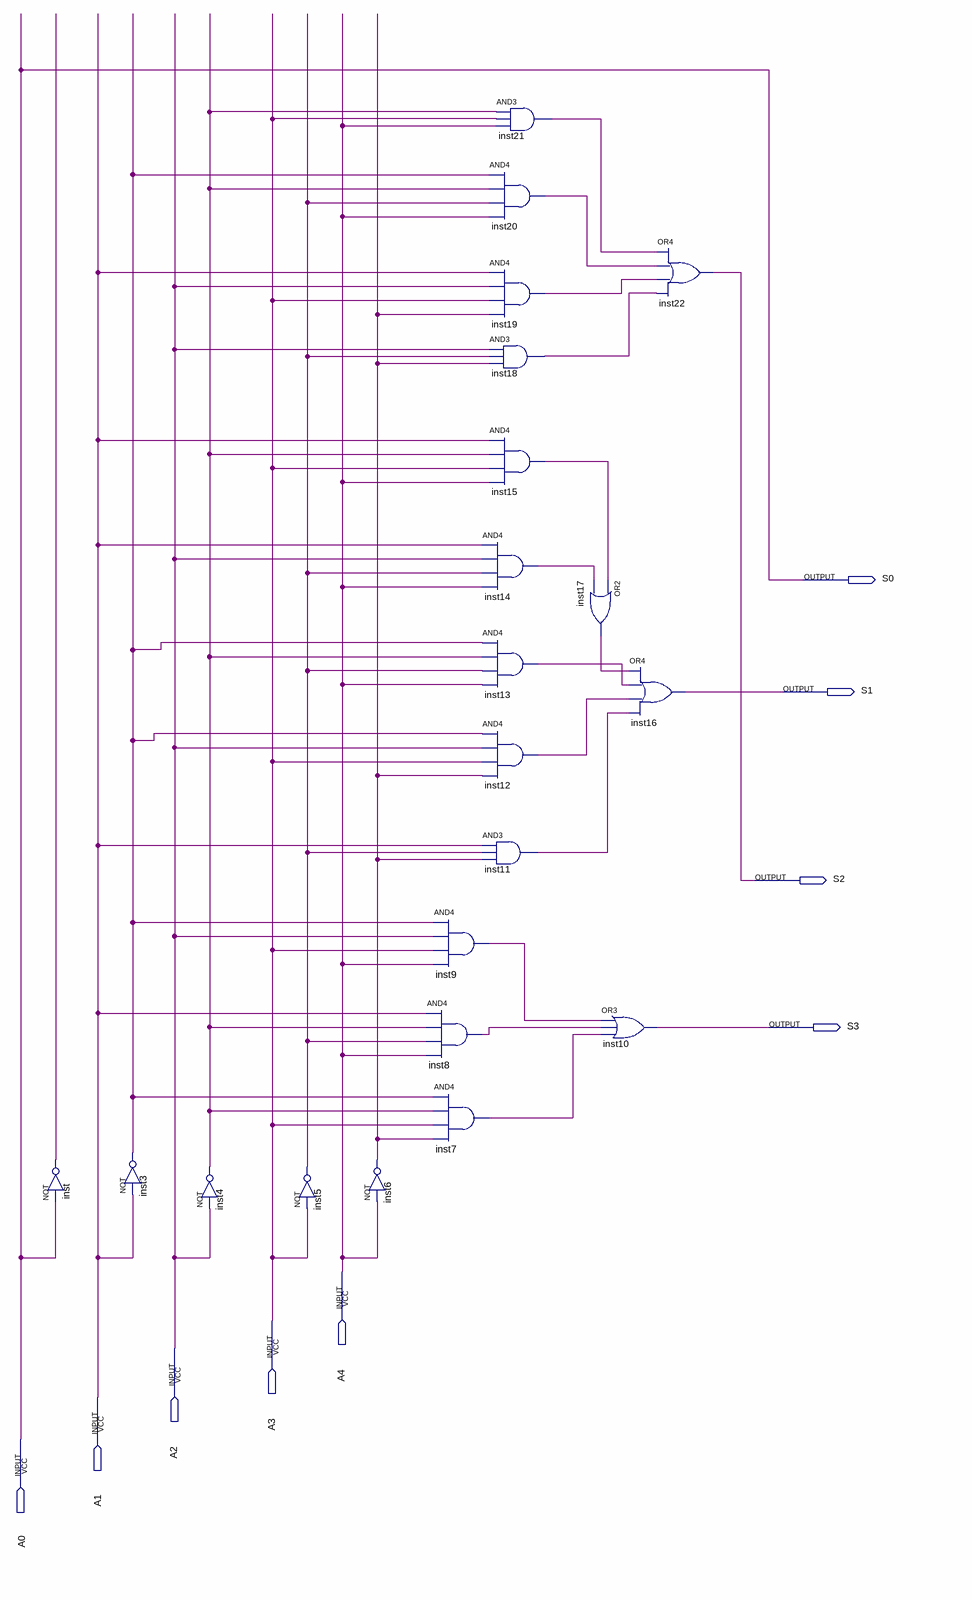
[diagram p0: schematic sheet]
// Quartus schematic decodificador6bit.bdf as structural Verilog: 21 symbols, 9 pins
module decodificador6bit (
  input  A4,
  input  A3,
  input  A2,
  input  A1,
  input  A0,
  output S0,
  output S1,
  output S2,
  output S3
);

  wire inst3_out, inst4_out, inst5_out, inst6_out, inst7_out, inst8_out, inst9_out, inst11_out, inst12_out,
       inst13_out, inst14_out, inst15_out, inst17_out, inst18_out, inst19_out, inst20_out, inst21_out,
       inst_out;

  not inst (inst_out, A0);
  not inst3 (inst3_out, A1);
  not inst4 (inst4_out, A2);
  not inst5 (inst5_out, A3);
  not inst6 (inst6_out, A4);
  and inst9 (inst9_out, inst3_out, A2, A3, A4);
  and inst8 (inst8_out, A1, inst4_out, inst5_out, A4);
  and inst7 (inst7_out, inst3_out, inst4_out, A3, inst6_out);
  and inst21 (inst21_out, inst4_out, A3, A4);
  and inst20 (inst20_out, inst3_out, inst4_out, inst5_out, A4);
  and inst19 (inst19_out, A1, A2, A3, inst6_out);
  and inst18 (inst18_out, A2, inst5_out, inst6_out);
  and inst15 (inst15_out, A1, inst4_out, A3, A4);
  and inst14 (inst14_out, A1, A2, inst5_out, A4);
  and inst13 (inst13_out, inst3_out, inst4_out, inst5_out, A4);
  and inst12 (inst12_out, inst3_out, A2, A3, inst6_out);
  and inst11 (inst11_out, A1, inst5_out, inst6_out);
  or inst17 (inst17_out, inst15_out, inst14_out);
  or inst10 (S3, inst9_out, inst8_out, inst7_out);
  or inst22 (S2, inst21_out, inst20_out, inst19_out, inst18_out);
  or inst16 (S1, inst17_out, inst13_out, inst12_out, inst11_out);

  assign S0 = A0;
endmodule
